# Altium project MARCS TB.PrjPcb
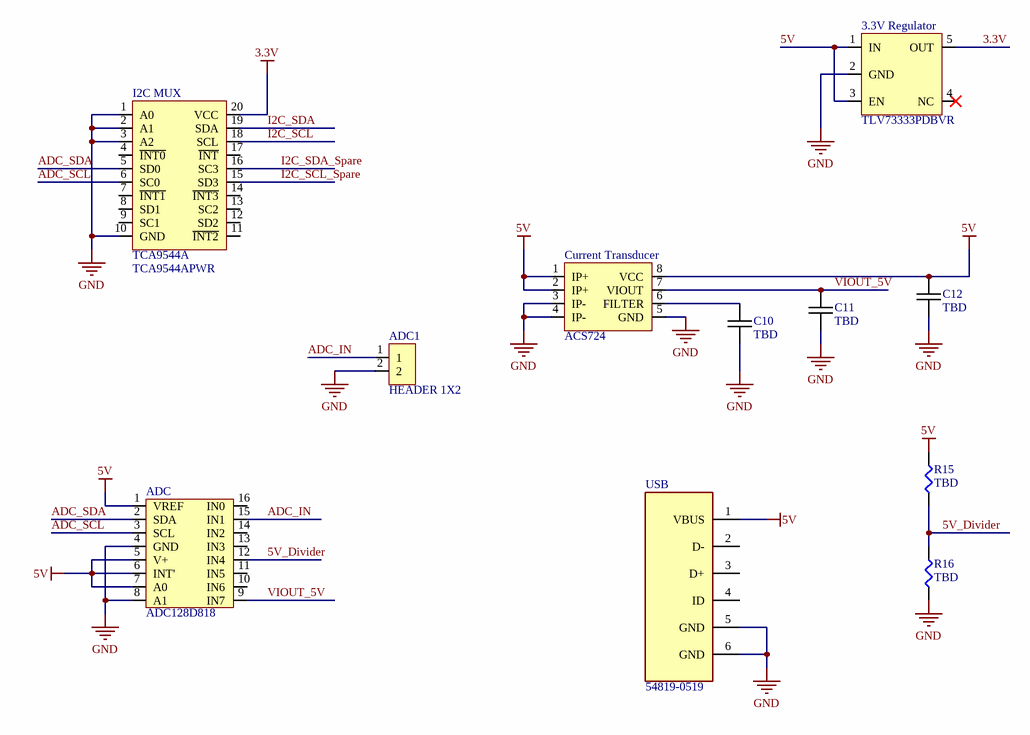
[diagram p0: MARCS ARM TB ICs Schematic.SchDoc]
2 sheets, 42 parts. Net scope: global (net labels, ports and power ports of the same name join across sheets).
Board file: MARCS ARM TB V1 PCB.PcbDoc
Sheets:
  MARCS ARM TB ICs Schematic.SchDoc
  MARCS TB ARM Schematic.SchDoc

## Sheet MARCS ARM TB ICs Schematic.SchDoc
size A

### Parts
3.3V_Regulator  TLV73333PDBVR  [TLV733P]
ADC  ADC128D818  [ADC128D818 V3]
ADC1  HEADER 1X2  [Header 1x2]
C10  TBD  [0805C-GENERIC]
C11  TBD  [0805C-GENERIC]
C12  TBD  [0805C-GENERIC]
Current_Transducer  ACS724  [SOIC-8 V3]
I2C_MUX  TCA9544A  Supplier Part Number 1: TCA9544APWR  [TSSOP20]
R15  TBD  [0805R-GENERIC]
R16  TBD  [0805R-GENERIC]
USB  Part Number: 54819-0519  [Molex_54819-0519_0]  (hidden comment: Conn_Molex_54819-0519_eec)

### Nets
3.3V: 3.3V_Regulator.5(OUT) I2C_MUX.20(VCC)
5V: 3.3V_Regulator.1(IN) 3.3V_Regulator.3(EN) ADC.1(VREF) ADC.5(V+) ADC.6(INT') ADC.7(A0) C12.1 Current_Transducer.1(IP+) Current_Transducer.2(IP+) Current_Transducer.8(VCC) R15.2 USB.1(VBUS)
GND: 3.3V_Regulator.2(GND) ADC.4(GND) ADC.8(A1) ADC1.2 C10.2 C11.2 C12.2 Current_Transducer.3(IP-) Current_Transducer.4(IP-) Current_Transducer.5(GND) I2C_MUX.1(A0) I2C_MUX.2(A1) I2C_MUX.3(A2) I2C_MUX.10(GND) R16.2 USB.5(GND) USB.6(GND)
5V_Divider: ADC.12(IN4) R15.1 R16.1
ADC_IN: ADC.15(IN1) ADC1.1
ADC_SCL: ADC.3(SCL) I2C_MUX.6(SC0)
ADC_SDA: ADC.2(SDA) I2C_MUX.5(SD0)
I2C_SCL: I2C_MUX.18(SCL)
I2C_SCL_Spare: I2C_MUX.15(SD3)
I2C_SDA: I2C_MUX.19(SDA)
I2C_SDA_Spare: I2C_MUX.16(SC3)
VIOUT_5V: ADC.9(IN7) C11.1 Current_Transducer.7(VIOUT)
NetC10_1: C10.1 Current_Transducer.6(FILTER)

Not connected (* = marked no-connect by the designer): 3.3V_Regulator 4(NC)*; ADC 10(IN6) 11(IN5) 13(IN3) 14(IN2) 16(IN0); I2C_MUX 4(~{INT0}) 7(~{INT1}) 8(SD1) 9(SC1) 11(~{INT2}) 12(SD2) 13(SC2) 14(~{INT3}) 17(~{INT}); USB 2(D-) 3(D+) 4(ID)

### Notes on the sheet
- Size
- Rev
- Operated by Fermi Research Alliance, LLC under Contract No. DE-AC02-07CH11359 with the United States Department of Energy.
- Number
- B
- Date:
- Time:
- Sheet
- of
- ENGINEER:
- DRAWN:
- CHECKED:
- APPROVED:

### Library data of the parts
3.3V_Regulator = TLV733
C10-C12 = 0805C-TBD: CAPACITOR 0805 CERAMIC VALUE TO BE DETERMINED
R15 R16 = 0805R-TBD: RESISTOR 0805 VALUE TO BE DETERMINED
USB = Conn_Molex_54819-0519_eec: CONN USB - mini B USB 2.0 OTG Receptacle Connector 5 Position Through Hole, Right Angle; Manufacturer: Molex; Is Female: yes; helpURL: https://upverter.com/upn/revision/57f7d65304c3d878/; ComponentLink2Description: Datasheet; Temperature: -20°C to +85°C; Package: CONN_PTH_7MM7_9MM0_USB; Supplier 2: Mouser; Supplier 1: Digi-Key; ComponentLink1URL: https://upverter.com/upn/revision/57f7d65304c3d878/; Supplier Part Number 2: 538-54819-0519; Supplier Part Number 1: WM17115-ND; ComponentLink1Description: Upverter; ComponentLink2URL: https://upverter.com/datasheet/9d71f2f8719b3fc0715bd6f9e6d9d5a5d296bb87.pdf; RoHS: TRUE; Mouser Part Number: 538-54819-0519; Temperature Range High: +85°C; Digikey Description: CONN USB - mini B USB 2.0 OTG Receptacle Connector 5 Position Through Hole, Right Angle; Digikey Part Number: WM17115-ND; Lead Free: yes; Temperature Range Low: -20°C
I2C_MUX = TCA9544A: Supplier 1: Arrow Electronics, Inc.

## Sheet MARCS TB ARM Schematic.SchDoc
size B
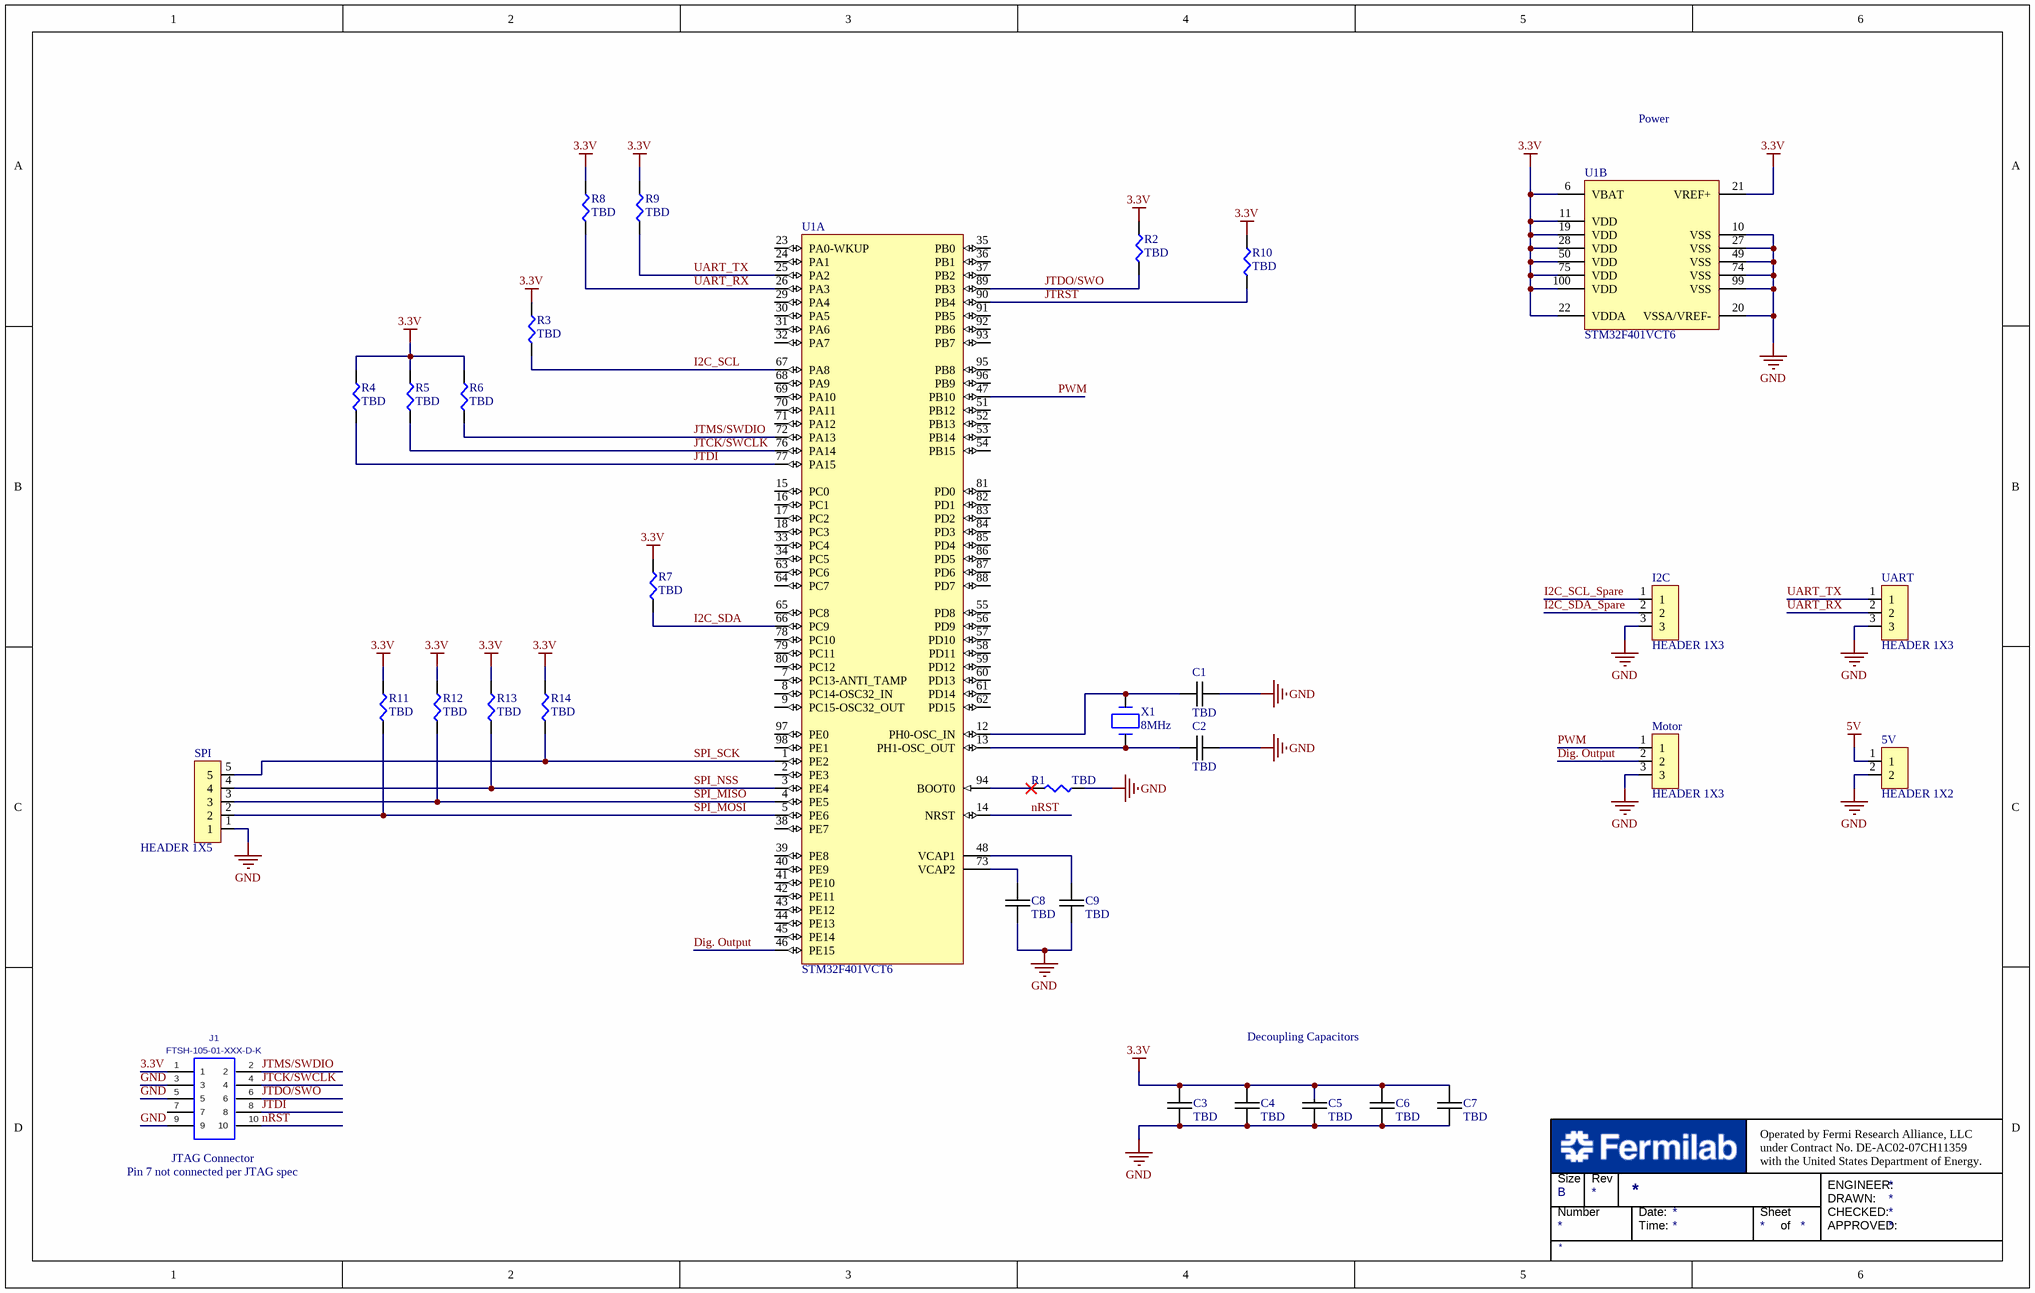
[diagram p1: MARCS TB ARM Schematic.SchDoc]

### Parts
5V  HEADER 1X2  [Header 1x2]
C1  TBD  [0805C-GENERIC]
C2  TBD  [0805C-GENERIC]
C3  TBD  [0805C-GENERIC]
C4  TBD  [0805C-GENERIC]
C5  TBD  [0805C-GENERIC]
C6  TBD  [0805C-GENERIC]
C7  TBD  [0805C-GENERIC]
C8  TBD  [0805C-GENERIC]
C9  TBD  [0805C-GENERIC]
I2C  HEADER 1X3  [Header 1x3]
J1  FTSH-105-01-XXX-D-K  [FTSH-105-01-XXX-D-K]
Motor  HEADER 1X3  [Header 1x3]
R1  TBD  [0805R-GENERIC]
R2  TBD  [0805R-GENERIC]
R3  TBD  [0805R-GENERIC]
R4  TBD  [0805R-GENERIC]
R5  TBD  [0805R-GENERIC]
R6  TBD  [0805R-GENERIC]
R7  TBD  [0805R-GENERIC]
R8  TBD  [0805R-GENERIC]
R9  TBD  [0805R-GENERIC]
R10  TBD  [0805R-GENERIC]
R11  TBD  [0805R-GENERIC]
R12  TBD  [0805R-GENERIC]
R13  TBD  [0805R-GENERIC]
R14  TBD  [0805R-GENERIC]
SPI  HEADER 1X5  [Header 1x5]
U1  STM32F401VCT6  [STM-LQFP100_N]  (parts A,B of 2)
UART  HEADER 1X3  [Header 1x3]
X1  8MHz  [GC0800044]

### Nets
3.3V: C3.1 C4.1 C5.1 C6.1 C7.1 J1.1 R2.1 R3.1 R4.1 R5.1 R6.1 R7.1 R8.1 R9.1 R10.1 R11.1 R12.1 R13.1 R14.1 U1.6(VBAT) U1.11(VDD) U1.19(VDD) U1.21(VREF+) U1.22(VDDA) U1.28(VDD) U1.50(VDD) U1.75(VDD) U1.100(VDD)
5V: 5V.1
GND: 5V.2 C1.2 C2.2 C3.2 C4.2 C5.2 C6.2 C7.2 C8.2 C9.2 I2C.3 J1.3 J1.5 J1.9 Motor.3 R1.2 SPI.1 U1.10(VSS) U1.20(VSSA/VREF-) U1.27(VSS) U1.49(VSS) U1.74(VSS) U1.99(VSS) UART.3
Dig. Output: Motor.2 U1.46(PE15)
I2C_SCL: R3.2 U1.67(PA8)
I2C_SCL_Spare: I2C.1
I2C_SDA: R7.2 U1.66(PC9)
I2C_SDA_Spare: I2C.2
JTCK/SWCLK: J1.4 R5.2 U1.76(PA14)
JTDI: J1.8 R4.2 U1.77(PA15)
JTDO/SWO: J1.6 R2.2 U1.89(PB3)
JTMS/SWDIO: J1.2 R6.2 U1.72(PA13)
JTRST: R10.2 U1.90(PB4)
nRST: J1.10 U1.14(NRST)
PWM: Motor.1 U1.47(PB10)
SPI_MISO: R12.2 SPI.3 U1.4(PE5)
SPI_MOSI: R11.2 SPI.2 U1.5(PE6)
SPI_NSS: R13.2 SPI.4 U1.3(PE4)
SPI_SCK: R14.2 SPI.5 U1.1(PE2)
UART_RX: R8.2 U1.26(PA3) UART.2
UART_TX: R9.2 U1.25(PA2) UART.1
NetC1_1: C1.1 U1.12(PH0-OSC_IN) X1.1
NetC2_1: C2.1 U1.13(PH1-OSC_OUT) X1.2
NetC8_1: C8.1 U1.73(VCAP2)
NetC9_1: C9.1 U1.48(VCAP1)
NetR1_1: R1.1 U1.94(BOOT0)

Not connected (* = marked no-connect by the designer): J1 7; U1 2(PE3) 7(PC13-ANTI_TAMP) 8(PC14-OSC32_IN) 9(PC15-OSC32_OUT) 15(PC0) 16(PC1) 17(PC2) 18(PC3) 23(PA0-WKUP) 24(PA1) 29(PA4) 30(PA5) 31(PA6) 32(PA7) 33(PC4) 34(PC5) 35(PB0) 36(PB1) 37(PB2) 38(PE7) 39(PE8) 40(PE9) 41(PE10) 42(PE11) 43(PE12) 44(PE13) 45(PE14) 51(PB12) 52(PB13) 53(PB14) 54(PB15) 55(PD8) 56(PD9) 57(PD10) 58(PD11) 59(PD12) 60(PD13) 61(PD14) 62(PD15) 63(PC6) 64(PC7) 65(PC8) 68(PA9) 69(PA10) 70(PA11) 71(PA12) 78(PC10) 79(PC11) 80(PC12) 81(PD0) 82(PD1) 83(PD2) 84(PD3) 85(PD4) 86(PD5) 87(PD6) 88(PD7) 91(PB5) 92(PB6) 93(PB7) 95(PB8) 96(PB9) 97(PE0) 98(PE1)

### Notes on the sheet
- Power
- Decoupling Capacitors
- (near J1) Pin 7 not connected per JTAG spec
- (near J1) JTAG Connector
- Size
- Rev
- Operated by Fermi Research Alliance, LLC under Contract No. DE-AC02-07CH11359 with the United States Department of Energy.
- Number
- B
- Date:
- Time:
- Sheet
- of
- ENGINEER:
- DRAWN:
- CHECKED:
- APPROVED:

### Library data of the parts
C1-C9 = 0805C-TBD: as C10 on sheet MARCS ARM TB ICs Schematic
J1 = FTSH-105-01-XXX-D-K: TERMINAL STRIP, .050"(1.27mm) PITCH, 10 PINS, KEYING OPTION.; MANUFACTURER: SAMTEC; CREATED: September 26, 2016 - Wendy Xin; PCB DECAL: FTSH-105-01-XXX-D-K
R1-R14 = 0805R-TBD: RESISTOR 0805 VALUE TO BE DETERMINED
U1 = STM32F401VCT6: ARM Cortex-M4 32-bit MCU+FPU, 105 DMIPS, 256 kB Flash, 64 kB Internal RAM, 79 I/Os, 100-pin LQFP, -40 to 85 degC, Tray; Manufacturer: STMicroelectronics; FLASH Size (Prog) (kB): 256; I/Os (High Current): 79; Internal RAM Size (kB): 64; Operating Frequency(F) (Processor speed) (MHz): 84; Supply Voltage(Vcc) max (V): 3.6; Supply Voltage(Vcc) min (V): 1.8; DatasheetVersion: Rev. 1; PackageVersion: Rev. 1, 06/2013; PackageReference: LQFP100; PackageDescription: 100-Pin Low Profile Quad Flat Package, 14 x 14 mm Body, 0.5 mm Pitch; Supplier 1: Digi-Key; Supplier Part Number 1: 497-14048-ND; Supplier 2: Newark; Supplier Part Number 2: 19X6223; Supplier 3: Mouser; Supplier Part Number 3: 511-STM32F401VCT6; Core: ARM Cortex-M4; Packing: Tray; Mounting Technology: Surface Mount; PartNumber: STM32F401VCT6; ComponentLink1Description: Manufacturer URL; ComponentLink1URL: http://www.st.com/web/en/home.html; ComponentLink2Description: Datasheet; ComponentLink2URL: http://www.st.com/st-web-ui/static/active/en/resource/technical/document/data_brief/DM00071938.pdf; ComponentLink3Description: Package Specification; ComponentLink3URL: http://www.st.com/st-web-ui/static/active/en/resource/technical/document/data_brief/DM00071938.pdf
X1 = GC0800044: Diodes Incorporated GC0800044; Supplier 1: Digi-Key; Supplier Part Number 1: GC0800044TR-ND

## Nets that join several sheets
3.3V: MARCS ARM TB ICs Schematic (3.3V_Regulator.5 I2C_MUX.20), MARCS TB ARM Schematic (28 pins)
5V: MARCS ARM TB ICs Schematic (12 pins), MARCS TB ARM Schematic (5V.1)
GND: MARCS ARM TB ICs Schematic (17 pins), MARCS TB ARM Schematic (24 pins)
I2C_SCL: MARCS ARM TB ICs Schematic (I2C_MUX.18), MARCS TB ARM Schematic (R3.2 U1.67)
I2C_SCL_Spare: MARCS ARM TB ICs Schematic (I2C_MUX.15), MARCS TB ARM Schematic (I2C.1)
I2C_SDA: MARCS ARM TB ICs Schematic (I2C_MUX.19), MARCS TB ARM Schematic (R7.2 U1.66)
I2C_SDA_Spare: MARCS ARM TB ICs Schematic (I2C_MUX.16), MARCS TB ARM Schematic (I2C.2)